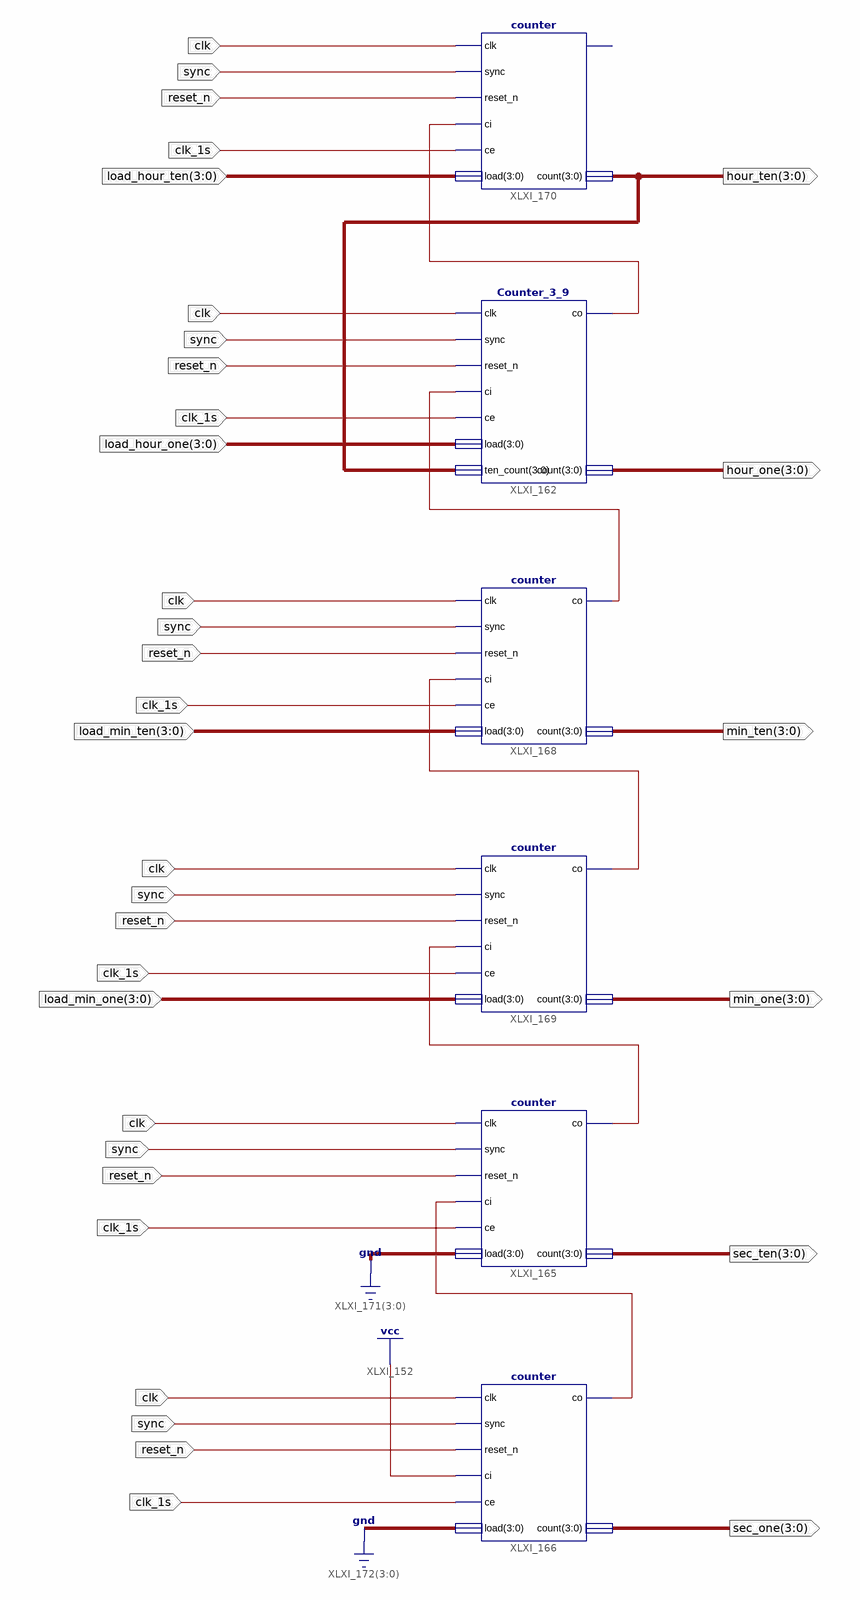
[diagram p0: schematic sheet 1]
// Xilinx ISE schematic Clock.sch (xbr) as structural Verilog: 6 symbols, 14 ports
module Clock (
  input  [3:0] load_hour_ten,
  input  [3:0] load_min_ten,
  input  [3:0] load_min_one,
  input  clk,
  input  sync,
  input  reset_n,
  input  clk_1s,
  input  [3:0] load_hour_one,
  output [3:0] sec_ten,
  output [3:0] sec_one,
  output [3:0] min_ten,
  output [3:0] min_one,
  output [3:0] hour_one,
  output [3:0] hour_ten
);

  wire XLXN_344, XLXN_361, XLXN_362, XLXN_365, XLXN_366;

  counter #(.count_max_value(0101)) XLXI_165 (
    .clk(clk), .sync(sync), .reset_n(reset_n), .ci(XLXN_344), .ce(clk_1s), .load(4'b0000), .co(XLXN_361),
    .count(sec_ten));
  counter #(.count_max_value(1001)) XLXI_166 (
    .clk(clk), .sync(sync), .reset_n(reset_n), .ci(1'b1), .ce(clk_1s), .load(4'b0000), .co(XLXN_344),
    .count(sec_one));
  counter #(.count_max_value(0101)) XLXI_168 (
    .clk(clk), .sync(sync), .reset_n(reset_n), .ci(XLXN_362), .ce(clk_1s), .load(load_min_ten),
    .co(XLXN_365), .count(min_ten));
  counter #(.count_max_value(1001)) XLXI_169 (
    .clk(clk), .sync(sync), .reset_n(reset_n), .ci(XLXN_361), .ce(clk_1s), .load(load_min_one),
    .co(XLXN_362), .count(min_one));
  Counter_3_9 XLXI_162 (
    .clk(clk), .sync(sync), .reset_n(reset_n), .ci(XLXN_365), .ce(clk_1s), .load(load_hour_one),
    .ten_count(hour_ten), .co(XLXN_366), .count(hour_one));
  counter #(.count_max_value(0010)) XLXI_170 (
    .clk(clk), .sync(sync), .reset_n(reset_n), .ci(XLXN_366), .ce(clk_1s), .load(load_hour_ten),
    .count(hour_ten));  // open: co
endmodule
